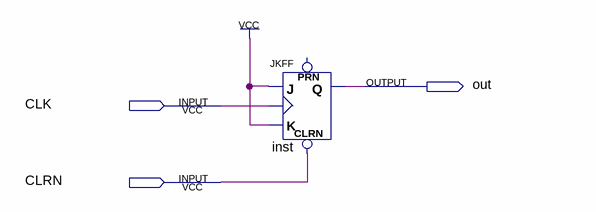
[diagram p0: schematic sheet]
// Quartus schematic 2SyncCounter.bdf as structural Verilog: 1 symbols, 3 pins
module \2SyncCounter  (
  input  CLK,
  input  CLRN,
  output out
);

  JKFF inst (.CLRN(CLRN), .K(1'b1), .J(1'b1), .CLK(CLK), .Q(out));  // open: PRN
endmodule
